# EAGLE design memory (EAGLE 9.3.0)
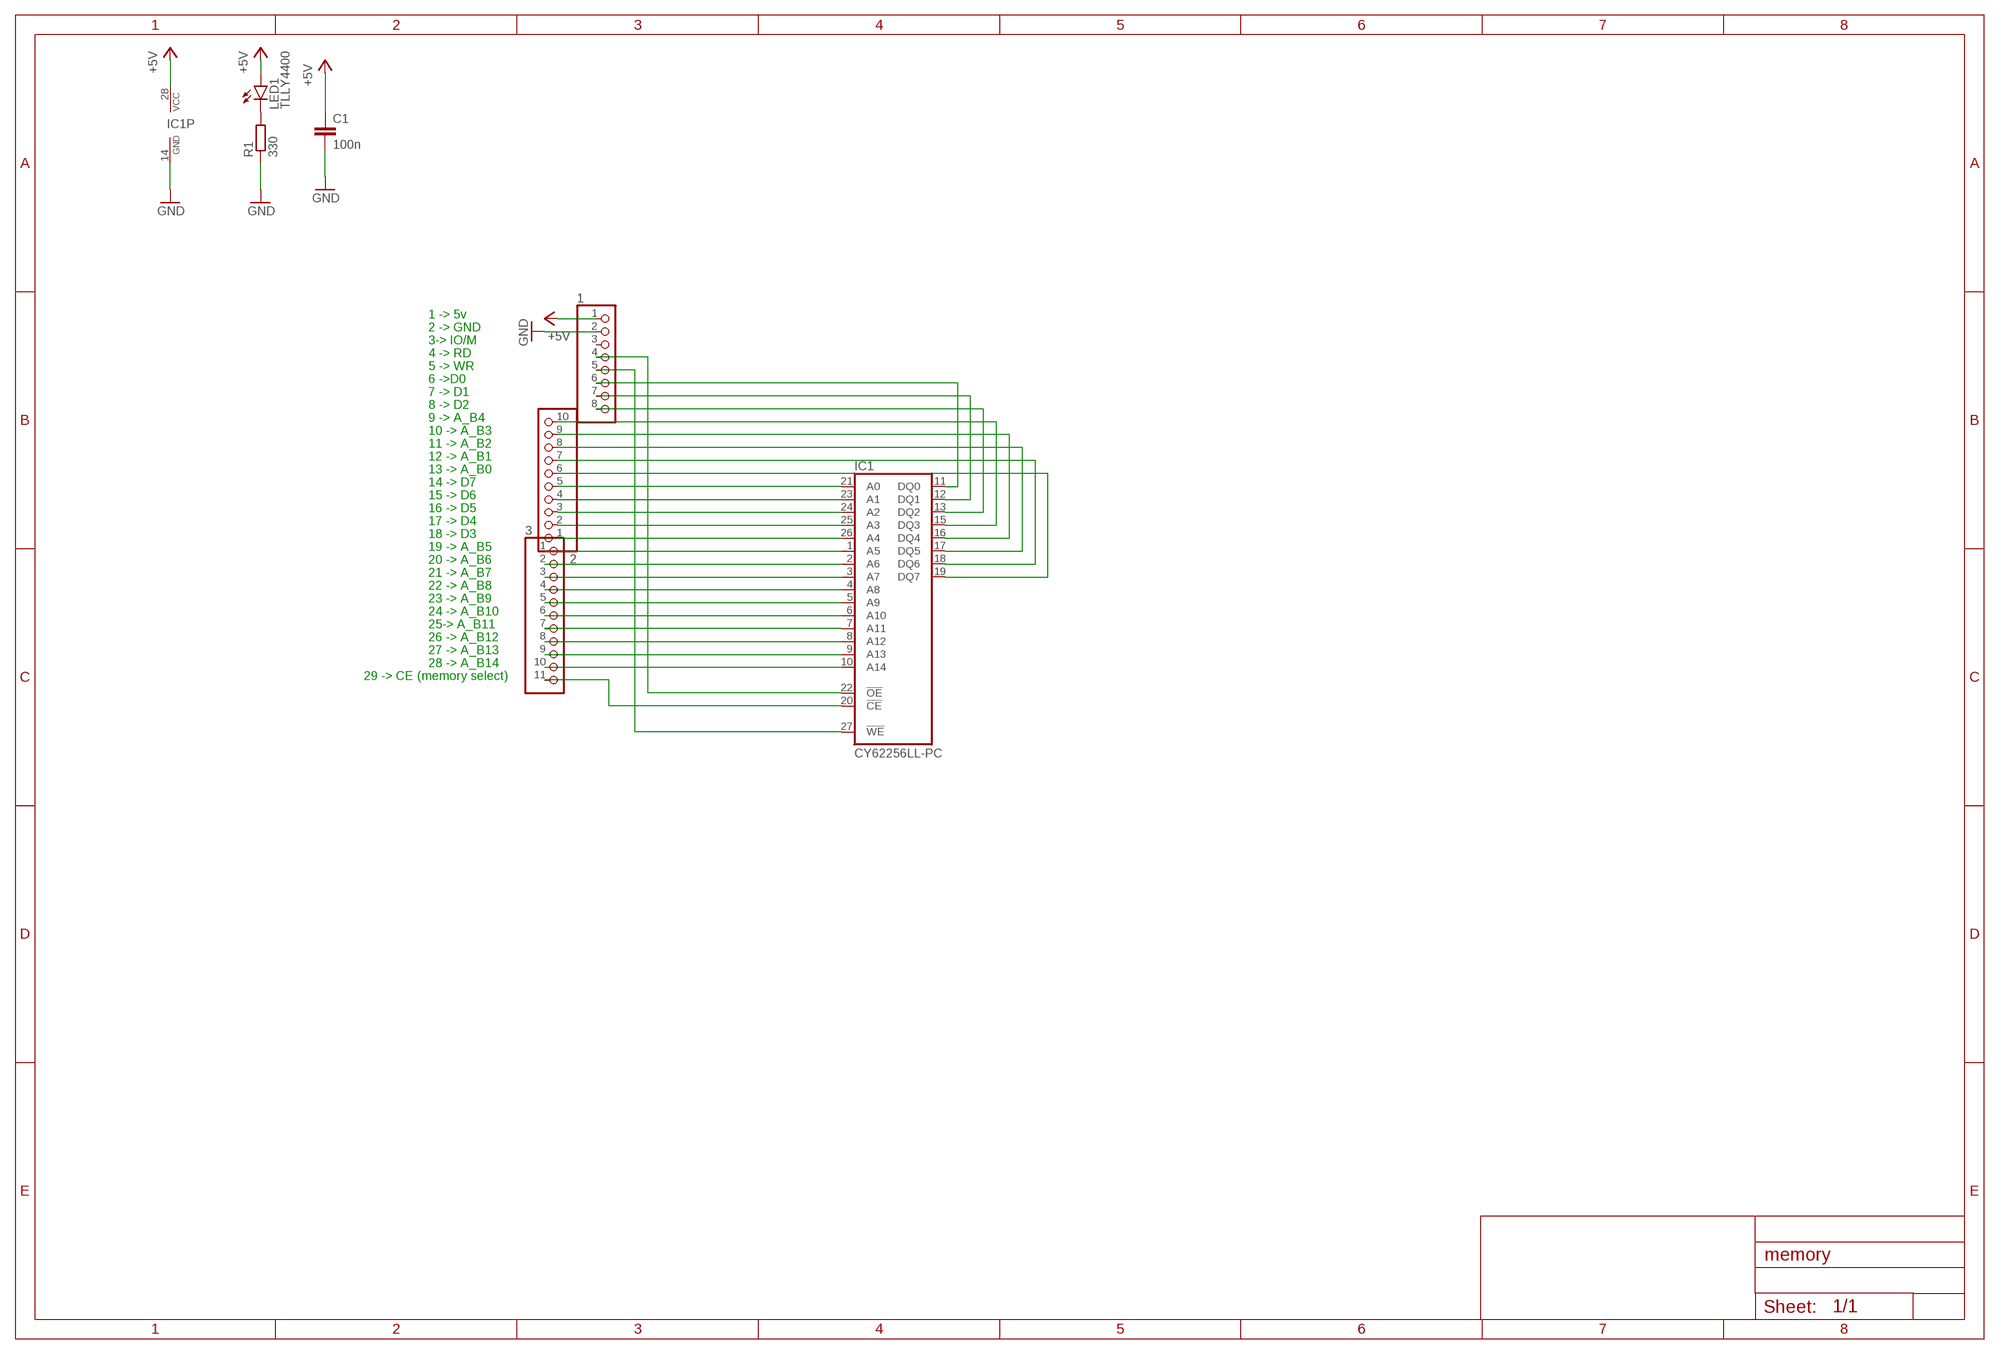
[diagram p0: schematic, sheet 1]

## Parts
1  PINHD-1X8/90  [1X08/90]
2  PINHD-1X10/90  [1X10/90]
3  PINHD-1X11/90  [1X11/90]
C1  100n  C-EU025-025X050  [C025-025X050]
IC1  CY62256LL-PC  [DIL28-6]
LED1  TLLY4400  [LED3MM]
R1  330  R-EU_0207/7  [0207/7]

## Nets
+5V: 1.1 C1.1 IC1.28(VCC) LED1.A
GND: 1.2 C1.2 IC1.14(GND) R1.1
N$1: 2.5 IC1.21(A0)
N$2: 2.4 IC1.23(A1)
N$3: 2.3 IC1.24(A2)
N$4: 2.2 IC1.25(A3)
N$5: 2.1 IC1.26(A4)
N$6: 3.1 IC1.1(A5)
N$7: 3.2 IC1.2(A6)
N$8: 3.3 IC1.3(A7)
N$9: 3.4 IC1.4(A8)
N$10: 3.5 IC1.5(A9)
N$11: 3.6 IC1.6(A10)
N$12: 3.7 IC1.7(A11)
N$13: 3.8 IC1.8(A12)
N$14: 3.9 IC1.9(A13)
N$15: 3.10 IC1.10(A14)
N$16: 1.6 IC1.11(DQ0)
N$17: 1.7 IC1.12(DQ1)
N$18: 1.8 IC1.13(DQ2)
N$19: 2.10 IC1.15(DQ3)
N$20: 2.9 IC1.16(DQ4)
N$21: 2.8 IC1.17(DQ5)
N$22: 2.7 IC1.18(DQ6)
N$23: 2.6 IC1.19(DQ7)
N$24: LED1.K(C) R1.2
N$25: 1.5 IC1.27(!WE)
N$26: 1.4 IC1.22(!OE)
N$27: 3.11 IC1.20(!CE)
Unconnected: 1.3

## Notes on the sheet
- 1 -> 5v
- 2 -> GND
- 3-> IO/M
- 4 -> RD
- 5 -> WR
- 6 ->D0
- 7 -> D1
- 8 -> D2
- 9 -> A_B4
- 10 -> A_B3
- 11 -> A_B2
- 12 -> A_B1
- 13 -> A_B0
- 14 -> D7
- 15 -> D6
- 16 -> D5
- 17 -> D4
- 18 -> D3
- 19 -> A_B5
- 20 -> A_B6
- 21 -> A_B7
- 22 -> A_B8
- 23 -> A_B9
- 24 -> A_B10
- 25-> A_B11
- 26 -> A_B12
- 27 -> A_B13
- 28 -> A_B14
- 29 -> CE (memory select)

## Library data of the parts
1 = pinhead:PINHD-1X8: PIN HEADER
2 = pinhead:PINHD-1X10: PIN HEADER
3 = pinhead:PINHD-1X11: PIN HEADER
C1 = rcl:C-EU: CAPACITOR, European symbol; SPICEPREFIX: C
IC1 = memory-sram:CY62256LL-?*: 256K (32K x 8) CMOS-Static RAM Source: http://download.cypress.com.edgesuite.net/design_resources/datasheets/contents/cy62256_8.pdf
LED1 = led:TLLY4400: Low Current (2mA) LED 3 mm Tinted Diffused Package color YELLOW Source: Data sheet <http://www.farnell.com/datasheets/391098.pdf>; MF: VISHAY SEMICONDUCTOR; OC_FARNELL: 1612439
R1 = rcl:R-EU_: RESISTOR, European symbol; SPICEPREFIX: R

## Net classes
0 default: width 0.6 mm, drill 0.8 mm, clearance 0.5 mm

## Board
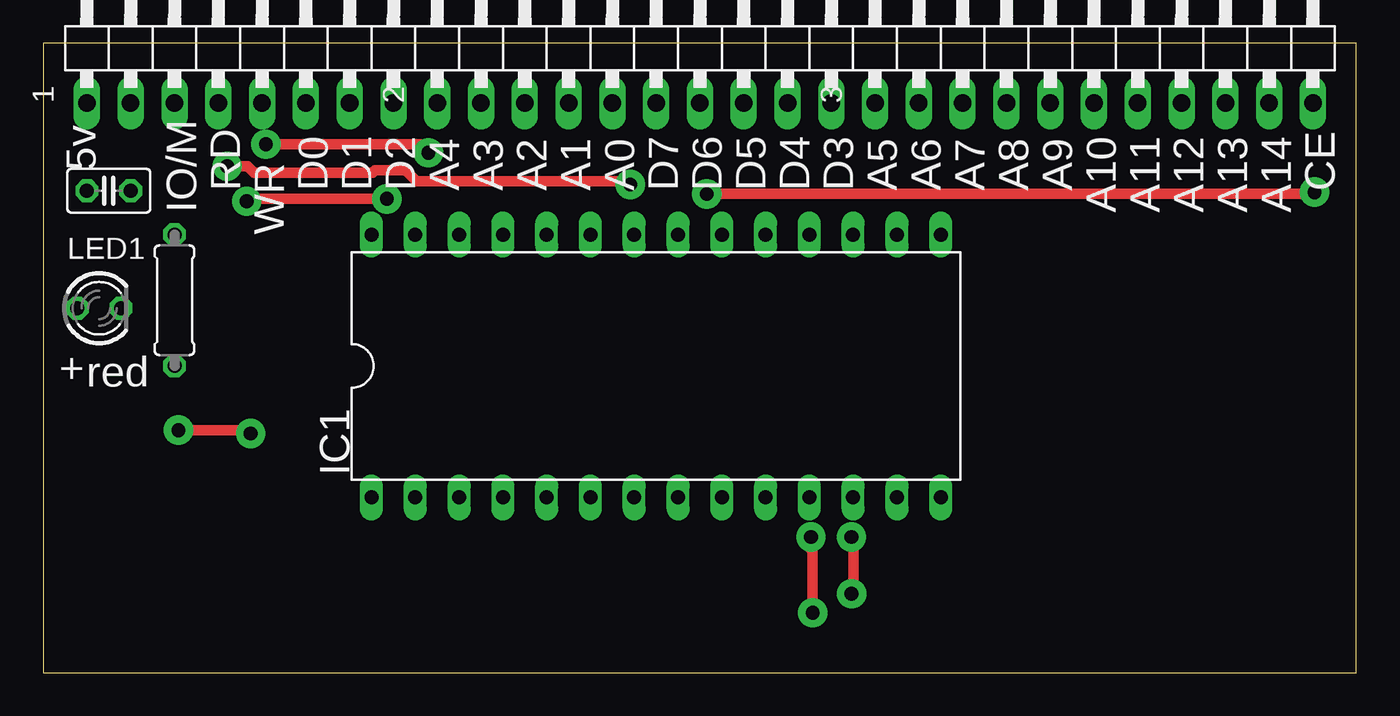
[diagram p1: board, top side]
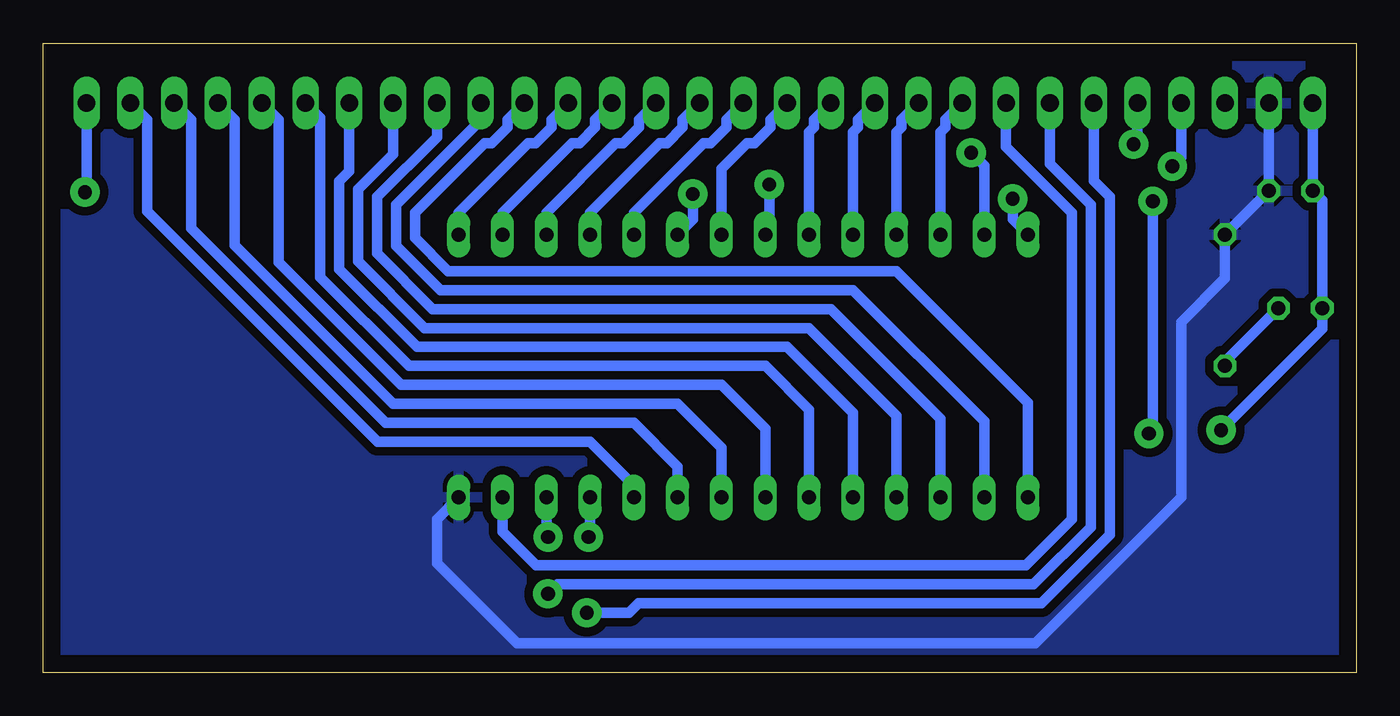
[diagram p2: board, bottom side, seen from below]

Size 76.18 x 36.5 mm. Coordinates in mm from the lower left corner, seen from the top.
Outline: 0,0 76.18,0 76.18,36.5 0,36.5 0,0
Copper layers (1*16): Top 0.035mm / dielectric 1.5mm / Bottom 0.035mm
Design rules "default": minimum track width 6mil, minimum drill 0.35mm, track to track 6mil, track to pad 6mil, pad to pad 6mil, via to via 6mil, smd to smd 6mil, copper to edge 40mil, drill to drill 6mil, minimum pad ring 10mil, minimum via ring 8mil, stop-mask expansion 4mil, vias tented up to drill 0mil, thermal gap 10mil

### Footprints (pad centres in the part's own frame; a part is rotated, then mirrored left to right if it is on the bottom)
1X08/90 = drill 1.016 long: 1 -8.89,-3.81; 2 -6.35,-3.81; 3 -3.81,-3.81; 4 -1.27,-3.81; 5 1.27,-3.81; 6 3.81,-3.81; 7 6.35,-3.81; 8 8.89,-3.81
1X10/90 = drill 1.016 long: 1 -11.43,-3.81; 2 -8.89,-3.81; 3 -6.35,-3.81; 4 -3.81,-3.81; 5 -1.27,-3.81; 6 1.27,-3.81; 7 3.81,-3.81; 8 6.35,-3.81; 9 8.89,-3.81; 10 11.43,-3.81
1X11/90 = drill 1.016 long: 1 -12.7,-3.81; 2 -10.16,-3.81; 3 -7.62,-3.81; 4 -5.08,-3.81; 5 -2.54,-3.81; 6 0,-3.81; 7 2.54,-3.81; 8 5.08,-3.81; 9 7.62,-3.81; 10 10.16,-3.81; 11 12.7,-3.81
C025-025X050 = drill 0.813 octagon: 1 -1.27,0; 2 1.27,0
DIL28-6 = drill 0.813 long: 1 -16.51,-7.62; 2 -13.97,-7.62; 3 -11.43,-7.62; 4 -8.89,-7.62; 5 -6.35,-7.62; 6 -3.81,-7.62; 7 -1.27,-7.62; 8 1.27,-7.62; 9 3.81,-7.62; 10 6.35,-7.62; 11 8.89,-7.62; 12 11.43,-7.62; 13 13.97,-7.62; 14 16.51,-7.62; 15 16.51,7.62; 16 13.97,7.62; 17 11.43,7.62; 18 8.89,7.62; 19 6.35,7.62; 20 3.81,7.62; 21 1.27,7.62; 22 -1.27,7.62; 23 -3.81,7.62; 24 -6.35,7.62; 25 -8.89,7.62; 26 -11.43,7.62; 27 -13.97,7.62; 28 -16.51,7.62
LED3MM = drill 0.813 octagon: A -1.27,0; K 1.27,0
0207/7 = drill 0.813 octagon: 1 -3.81,0; 2 3.81,0

### Placement (x,y rotation side)
1  11.43,36.83 0 top
2  34.29,36.83 0 top
3  60.96,36.83 0 top
C1  3.81,27.94 0 top
IC1  35.56,17.78 0 top
LED1  3.25,21.13 0 top
R1  7.62,21.59 270 top

### Tracks (layer width: path | path; a pad name or v marks a point on that pad's centre or on a via)
+5V  (via drill 0.8 pad 1.7)
  Top 0.6: v19.94,27.47 11.95,27.47 v11.81,27.33 | v12.04,13.86 11.84,14.06 v7.86,14.06
  Bottom 0.6: 1.1 C1.1 1.98,27.38 LED1.A 1.98,19.94 v7.86,14.06 | IC1.28 19.94,26.29 v19.94,27.47 | v11.81,27.33 11.81,14.08 v12.04,13.86
GND
  Bottom 0.6: 1.2 C1.2 R1.1 7.62,22.86 10.16,20.32 10.16,10.16 18.62,1.7 48.69,1.7 53.34,6.35 53.34,8.89 IC1.14
  pour Bottom: 0.01,36.67 0.01,-0.17 76.58,-0.17 76.58,36.47 75.96,36.47
N$1
  Bottom 0.6: IC1.21 36.83,29.21 35.34,30.7 34.91,30.7 34,31.61 34,32.04 2.5
N$2
  Bottom 0.6: 2.4 31.46,32.04 31.46,31.61 31.75,31.32 IC1.23
N$3
  Bottom 0.6: 2.3 28.92,32.04 28.92,31.61 29.21,31.32 IC1.24
N$4
  Bottom 0.6: 2.2 26.38,32.04 26.38,31.61 26.67,31.32 IC1.25
N$5
  Bottom 0.6: 2.1 23.84,32.04 23.84,31.61 24.13,31.32 IC1.26
N$6
  Bottom 0.6: 3.1 49.24,32.04 49.24,31.61 50.15,30.7 50.58,30.7 54.61,26.67 54.61,25.21 52.67,23.28 26.67,23.28 19.05,15.66 IC1.1
N$7
  Bottom 0.6: 3.2 50.8,32.04 55.71,27.13 55.71,24.76 53.13,22.18 29.21,22.18 21.59,14.56 IC1.2
N$8
  Bottom 0.6: 3.3 53.34,31.05 56.81,27.58 56.81,24.3 53.59,21.08 30.48,21.08 24.13,14.73 IC1.3
N$9
  Bottom 0.6: 3.4 55.88,30.07 57.91,28.04 57.91,23.85 54.04,19.98 31.75,19.98 26.67,14.9 IC1.4
N$10
  Bottom 0.6: 3.5 58.42,29.08 59.01,28.49 59.01,23.39 54.5,18.88 33.02,18.88 29.21,15.07 IC1.5
N$11
  Bottom 0.6: 3.6 60.11,32.17 60.11,22.94 54.95,17.78 34.29,17.78 31.75,15.24 IC1.6
N$12
  Bottom 0.6: 3.7 62.52,32.04 62.52,23.79 55.41,16.68 36.83,16.68 34.29,14.14 IC1.7
N$13
  Bottom 0.6: 3.8 65.06,32.04 65.06,24.78 55.86,15.58 39.37,15.58 36.83,13.04 IC1.8
N$14
  Bottom 0.6: 3.9 67.6,32.04 67.6,25.76 56.32,14.48 41.91,14.48 39.37,11.94 IC1.9
N$15
  Bottom 0.6: 3.10 70.14,32.04 70.14,26.75 56.78,13.38 44.45,13.38 41.91,10.84 IC1.10
N$16  (via drill 0.8 pad 1.7)
  Top 0.6: v44.64,3.47 44.64,7.07 44.43,7.28 44.43,7.76 v44.54,7.87
  Bottom 0.6: 1.6 15.24,28.51 14.31,27.58 14.31,7.98 18.27,4.02 41.65,4.02 42.2,3.47 v44.64,3.47 | v44.54,7.87 44.45,7.95 IC1.11
N$17  (via drill 0.8 pad 1.7)
  Top 0.6: v46.9,4.57 47.01,4.68 47.01,7.74 v46.89,7.87
  Bottom 0.6: 1.7 17.78,29.5 15.41,27.13 15.41,8.43 18.73,5.12 46.35,5.12 v46.9,4.57 | v46.89,7.87 46.99,7.97 IC1.12
N$18
  Bottom 0.6: 1.8 20.32,30.48 16.51,26.67 16.51,8.89 19.18,6.22 47.57,6.22 49.53,8.18 IC1.13
N$19
  Bottom 0.6: IC1.15 52.07,26.67 48.04,30.7 47.61,30.7 46.7,31.61 46.7,32.04 2.10
N$20
  Bottom 0.6: 2.9 44.16,32.04 44.16,31.61 45.07,30.7 45.5,30.7 49.53,26.67 IC1.16
N$21
  Bottom 0.6: IC1.17 46.99,26.67 42.96,30.7 42.53,30.7 41.62,31.61 41.62,32.04 2.8
N$22
  Bottom 0.6: IC1.18 44.45,26.67 40.42,30.7 39.99,30.7 39.08,31.61 39.08,32.04 2.7
N$23
  Bottom 0.6: IC1.19 41.91,26.67 37.88,30.7 37.45,30.7 36.54,31.61 36.54,32.04 2.6
N$24
  Bottom 0.6: LED1.K 7.62,18.03 R1.2
N$25  (via drill 0.8 pad 1.7)
  Top 0.6: v12.92,30.63 21.86,30.63 v22.35,30.15
  Bottom 0.6: 1.5 12.7,30.85 v12.92,30.63 | v22.35,30.15 21.59,29.39 IC1.27
N$26  (via drill 0.8 pad 1.7)
  Top 0.6: v10.68,29.36 11.86,29.36 12.24,28.98 19.12,28.98 19.26,29.12 21.04,29.12 21.66,28.5 33.86,28.5 v34.06,28.31
  Bottom 0.6: 1.4 10.16,29.88 v10.68,29.36 | v34.06,28.31 34.06,25.64 IC1.22
N$27  (via drill 0.8 pad 1.7)
  Top 0.6: v38.5,27.75 73.65,27.75 v73.76,27.86
  Bottom 0.6: IC1.20 38.5,26.28 v38.5,27.75 | v73.76,27.86 73.66,27.95 3.11

### Text on the board
tNames: 30-header_male_90_degree | 5v | RD | D0 | D1 | D2 | A4 | A3 | A2 | A1 | A0 | D7 | D6 | D5 | D4 | D3 | A5 | A6 | A7 | A8 | A9 | CE | IO/M | A10 | A11 | A12 | A13 | A14 | WR | + | red